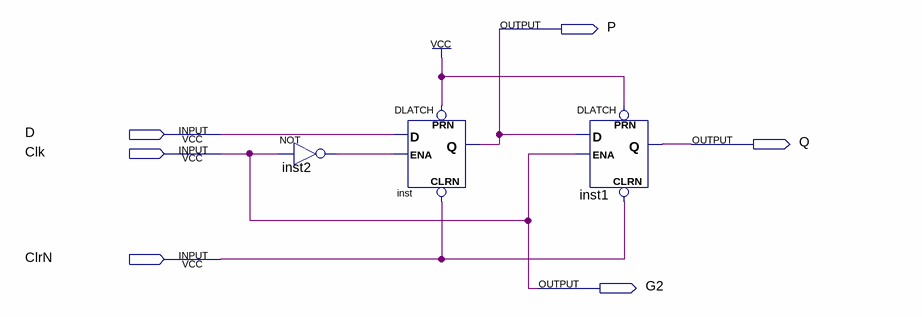
[diagram p0: schematic sheet]
// Quartus schematic D_latch.bdf as structural Verilog: 3 symbols, 6 pins
module D_latch (
  input  D,
  input  Clk,
  input  ClrN,
  output P,
  output Q,
  output G2
);

  wire inst2_out;

  not inst2 (inst2_out, Clk);
  DLATCH inst (.CLRN(ClrN), .D(D), .ENA(inst2_out), .PRN(1'b1), .Q(P));
  DLATCH inst1 (.CLRN(ClrN), .D(P), .ENA(Clk), .PRN(1'b1), .Q(Q));

  assign G2 = Clk;
endmodule
